# EAGLE design ders1 (EAGLE 9.2.2)
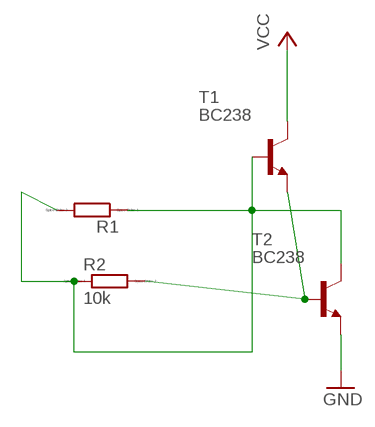
[diagram p0: schematic, sheet 1]

## Parts
R1  R  [R0805]
R2  10k  R  [R0805]
T1  BC238  [TO92]
T2  BC238  [TO92]

## Nets
GND: T2.1(E)
N$1: R2.2 T1.1(E) T2.2(B)
N$2: R1.1 R1.2 R2.1 T1.2(B) T2.3(C)
VCC: T1.3(C)

## Library data of the parts
R1 R2 = eagle-ltspice:R: RESISTOR, European symbol; SPICEMODEL: NONE; SPICEPREFIX: R
T1 T2 = transistor-neu-to92:BC238: NPN TRANSISTOR

## Board
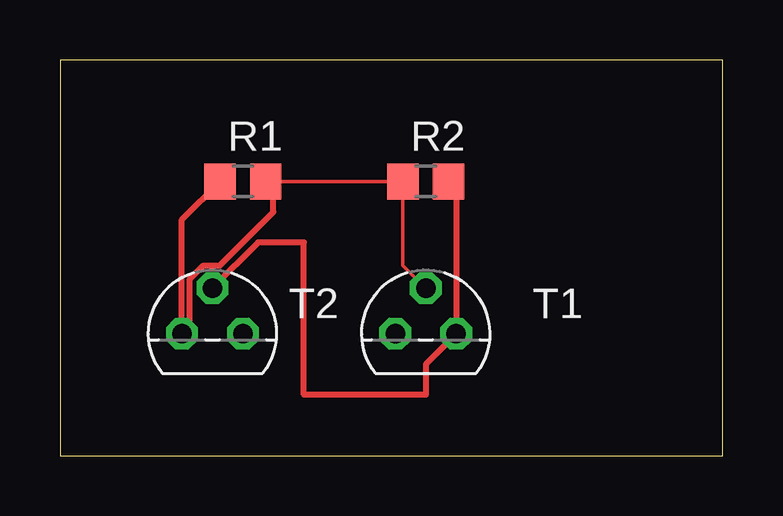
[diagram p1: board, top side]
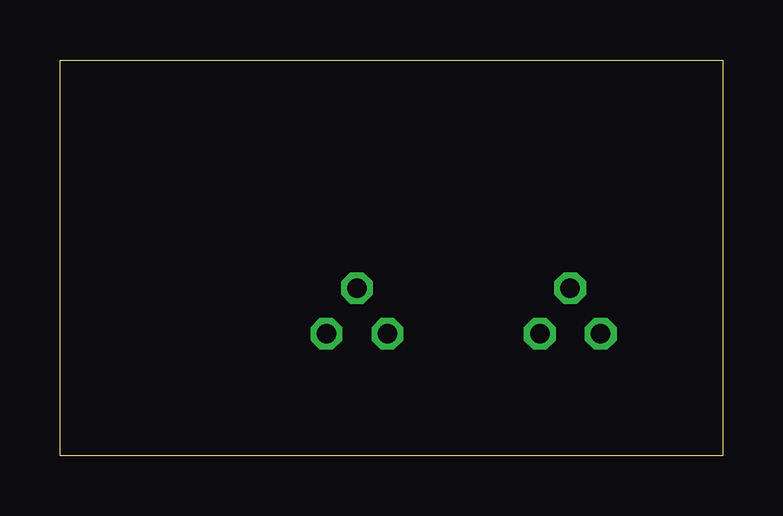
[diagram p2: board, bottom side, seen from below]

Size 27.61 x 16.5 mm. Coordinates in mm from the lower left corner, seen from the top.
Outline: 0,0 27.61,0 27.61,16.5 0,16.5 0,0
Copper layers (1*16): Top 0.035mm / dielectric 1.5mm / Bottom 0.035mm
Design rules "default": minimum track width 6mil, minimum drill 0.35mm, track to track 6mil, track to pad 6mil, pad to pad 6mil, via to via 6mil, smd to smd 6mil, copper to edge 40mil, drill to drill 6mil, minimum pad ring 10mil, minimum via ring 8mil, stop-mask expansion 4mil, vias tented up to drill 0mil, thermal gap 10mil

### Footprints (pad centres in the part's own frame; a part is rotated, then mirrored left to right if it is on the bottom)
R0805 = smd 1.3 x 1.5: 1 -0.95,0; 2 0.95,0
TO92 = drill 0.813 octagon: 1 1.27,0; 2 0,1.905; 3 -1.27,0

### Placement (x,y rotation side)
R1  7.62,11.43 0 top
R2  15.24,11.43 0 top
T1  15.24,5.08 0 top
T2  6.35,5.08 0 top

### Tracks (layer width: path | path; a pad name or v marks a point on that pad's centre or on a via)
N$1
  Top 0.152: T1.1 16.19,5.4
  Top 0.254: R2.2 16.51,11.11 T1.1 15.24,3.81 15.24,2.54 10.16,2.54 10.16,8.89 8.26,8.89 T2.2
  Bottom 0.254: T2.2 6.68,6.66
N$2
  Top 0.152: T1.2 14.29,7.93 R2.1 R1.2
  Top 0.254: R1.1 5.08,9.84 T2.3 5.41,5.41 5.41,7.37 5.96,7.92 6.66,7.92 8.89,10.16 8.89,11.11 R1.2